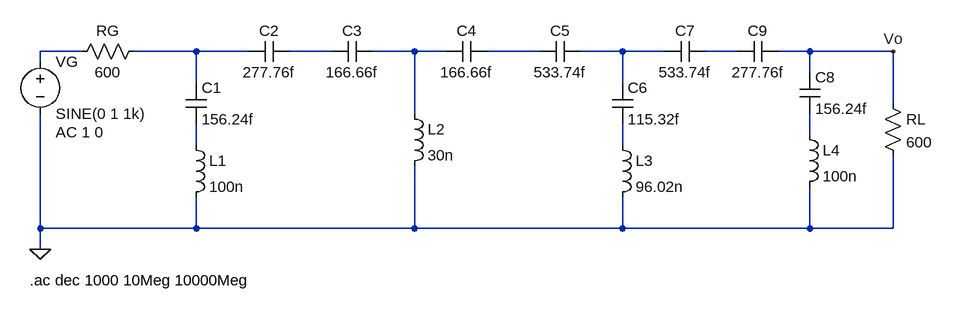
[diagram p0: schematic ej8.asc]
ej8.asc, the LTspice schematic file:
Version 4
SHEET 1 2804 1636
WIRE 32 96 -32 96
WIRE 208 96 112 96
WIRE 288 96 208 96
WIRE 416 96 352 96
WIRE 544 96 480 96
WIRE 592 96 544 96
WIRE 736 96 656 96
WIRE 864 96 800 96
WIRE 928 96 864 96
WIRE 1040 96 992 96
WIRE 1152 96 1104 96
WIRE 1280 96 1152 96
WIRE -32 112 -32 96
WIRE 1152 128 1152 96
WIRE 208 144 208 96
WIRE 864 144 864 96
WIRE 1280 176 1280 96
WIRE 544 192 544 96
WIRE 1152 224 1152 192
WIRE 208 240 208 208
WIRE 864 240 864 208
WIRE -32 368 -32 192
WIRE 208 368 208 320
WIRE 208 368 -32 368
WIRE 544 368 544 272
WIRE 544 368 208 368
WIRE 864 368 864 320
WIRE 864 368 544 368
WIRE 1152 368 1152 304
WIRE 1152 368 864 368
WIRE 1280 368 1280 256
WIRE 1280 368 1152 368
WIRE -32 400 -32 368
FLAG -32 400 0
FLAG 1280 96 Vo
SYMBOL voltage -32 96 R0
WINDOW 123 24 124 Left 2
WINDOW 39 0 0 Left 0
SYMATTR InstName VG
SYMATTR Value SINE(0 1 1k)
SYMATTR Value2 AC 1 0
SYMBOL res 128 80 R90
WINDOW 0 0 56 VBottom 2
WINDOW 3 32 56 VTop 2
SYMATTR InstName RG
SYMATTR Value 600
SYMBOL cap 192 144 R0
SYMATTR InstName C1
SYMATTR Value 156.24f
SYMBOL ind 192 224 R0
SYMATTR InstName L1
SYMATTR Value 100n
SYMBOL cap 352 80 R90
WINDOW 0 0 32 VBottom 2
WINDOW 3 32 32 VTop 2
SYMATTR InstName C2
SYMATTR Value 277.76f
SYMBOL cap 480 80 R90
WINDOW 0 0 32 VBottom 2
WINDOW 3 32 32 VTop 2
SYMATTR InstName C3
SYMATTR Value 166.66f
SYMBOL ind 528 176 R0
SYMATTR InstName L2
SYMATTR Value 30n
SYMBOL cap 656 80 R90
WINDOW 0 0 32 VBottom 2
WINDOW 3 32 32 VTop 2
SYMATTR InstName C4
SYMATTR Value 166.66f
SYMBOL cap 800 80 R90
WINDOW 0 0 32 VBottom 2
WINDOW 3 32 32 VTop 2
SYMATTR InstName C5
SYMATTR Value 533.74f
SYMBOL cap 848 144 R0
SYMATTR InstName C6
SYMATTR Value 115.32f
SYMBOL ind 848 224 R0
SYMATTR InstName L3
SYMATTR Value 96.02n
SYMBOL cap 992 80 R90
WINDOW 0 0 32 VBottom 2
WINDOW 3 32 32 VTop 2
SYMATTR InstName C7
SYMATTR Value 533.74f
SYMBOL cap 1136 128 R0
SYMATTR InstName C8
SYMATTR Value 156.24f
SYMBOL ind 1136 208 R0
SYMATTR InstName L4
SYMATTR Value 100n
SYMBOL cap 1104 80 R90
WINDOW 0 0 32 VBottom 2
WINDOW 3 32 32 VTop 2
SYMATTR InstName C9
SYMATTR Value 277.76f
SYMBOL res 1264 160 R0
SYMATTR InstName RL
SYMATTR Value 600
TEXT -48 448 Left 2 !.ac dec 1000 10Meg 10000Meg

The netlist it stands for:
* ej8.asc
VG N001 0 SINE(0 1 1k) AC 1 0
RG N002 N001 600
C1 N002 N009 156.24f
L1 N009 0 100n
C2 N003 N002 277.76f
C3 N004 N003 166.66f
L2 N004 0 30n
C4 N005 N004 166.66f
C5 N006 N005 533.74f
C6 N006 N010 115.32f
L3 N010 0 96.02n
C7 N007 N006 533.74f
C8 Vo N008 156.24f
L4 N008 0 100n
C9 Vo N007 277.76f
RL Vo 0 600
.ac dec 1000 10Meg 10000Meg
.backanno
.end